# Altium project EPS_V1.PrjPcb
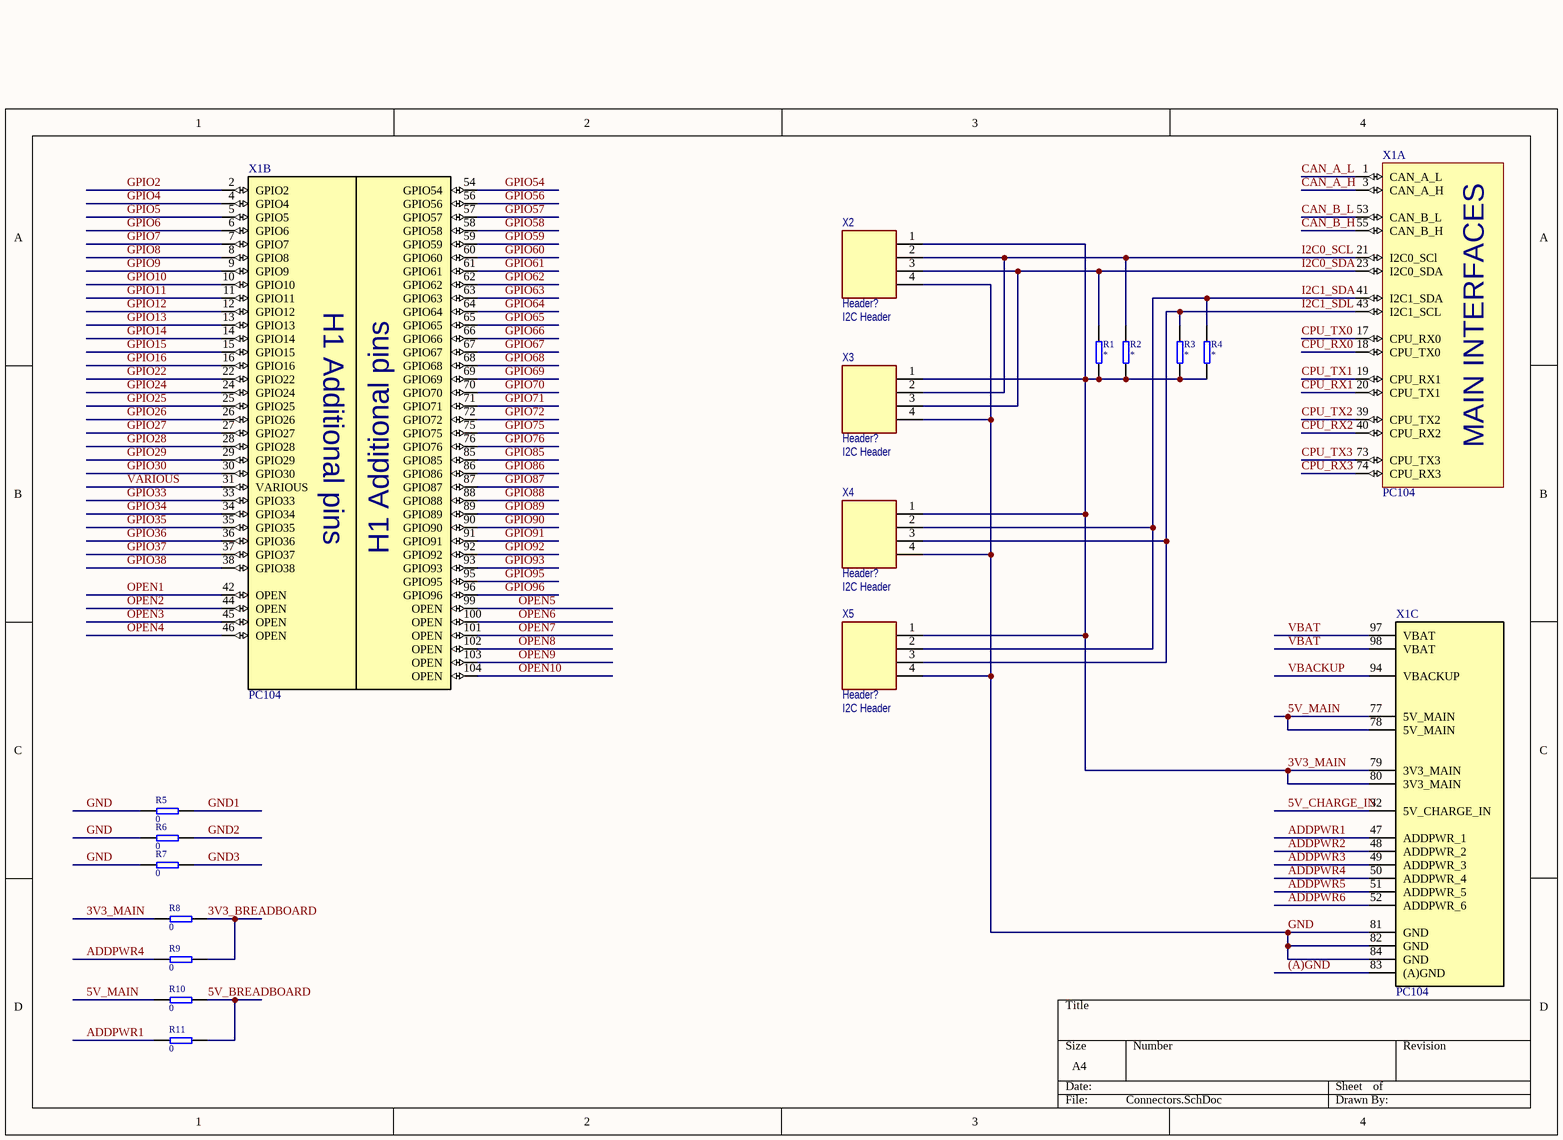
[diagram p0: Connectors.SchDoc]
1 sheet, 16 parts. Net scope: global (net labels, ports and power ports of the same name join across sheets).
Board file: EPS_V1.PcbDoc

## Sheet Connectors.SchDoc
size A4; SheetNumber: 1; SheetTotal: 1

### Parts
R1  (no value)  [RES 0603]
R2  (no value)  [RES 0603]
R3  (no value)  [RES 0603]
R4  (no value)  [RES 0603]
R5  value 0  [RES 0603]
R6  value 0  [RES 0603]
R7  value 0  [RES 0603]
R8  value 0  [RES 0603]
R9  value 0  [RES 0603]
R10  value 0  [RES 0603]
R11  value 0  [RES 0603]
X1  PC104  [PC104_ArianSpace]  (parts A,B,C of 3)
X2  Header?  Purpose: I2C Header  [PicoBlade_4P]
X3  Header?  Purpose: I2C Header  [PicoBlade_4P]
X4  Header?  Purpose: I2C Header  [PicoBlade_4P]
X5  Header?  Purpose: I2C Header  [PicoBlade_4P]

### Nets
3V3_BREADBOARD: R8.2 R9.2
3V3_MAIN: R1.2 R2.1 R3.1 R4.1 R8.1 X1.79(3V3_MAIN) X1.80(3V3_MAIN) X2.1 X3.1 X4.1 X5.1
5V_BREADBOARD: R10.2 R11.2
5V_CHARGE_IN: X1.32(5V_CHARGE_IN)
5V_MAIN: R10.1 X1.77(5V_MAIN) X1.78(5V_MAIN)
(A)GND: X1.83((A)GND)
ADDPWR1: R11.1 X1.47(ADDPWR_1)
ADDPWR2: X1.48(ADDPWR_2)
ADDPWR3: X1.49(ADDPWR_3)
ADDPWR4: R9.1 X1.50(ADDPWR_4)
ADDPWR5: X1.51(ADDPWR_5)
ADDPWR6: X1.52(ADDPWR_6)
CAN_A_H: X1.3(CAN_A_H)
CAN_A_L: X1.1(CAN_A_L)
CAN_B_H: X1.55(CAN_B_H)
CAN_B_L: X1.53(CAN_B_L)
CPU_RX0: X1.18(CPU_TX0)
CPU_RX1: X1.20(CPU_TX1)
CPU_RX2: X1.40(CPU_RX2)
CPU_RX3: X1.74(CPU_RX3)
CPU_TX0: X1.17(CPU_RX0)
CPU_TX1: X1.19(CPU_RX1)
CPU_TX2: X1.39(CPU_TX2)
CPU_TX3: X1.73(CPU_TX3)
GND: R5.1 R6.1 R7.1 X1.81(GND) X1.82(GND) X1.84(GND) X2.4 X3.4 X4.4 X5.4
GND1: R5.2
GND2: R6.2
GND3: R7.2
GPIO2: X1.2(GPIO2)
GPIO4: X1.4(GPIO4)
GPIO5: X1.5(GPIO5)
GPIO6: X1.6(GPIO6)
GPIO7: X1.7(GPIO7)
GPIO8: X1.8(GPIO8)
GPIO9: X1.9(GPIO9)
GPIO10: X1.10(GPIO10)
GPIO11: X1.11(GPIO11)
GPIO12: X1.12(GPIO12)
GPIO13: X1.13(GPIO13)
GPIO14: X1.14(GPIO14)
GPIO15: X1.15(GPIO15)
GPIO16: X1.16(GPIO16)
GPIO22: X1.22(GPIO22)
GPIO24: X1.24(GPIO24)
GPIO25: X1.25(GPIO25)
GPIO26: X1.26(GPIO26)
GPIO27: X1.27(GPIO27)
GPIO28: X1.28(GPIO28)
GPIO29: X1.29(GPIO29)
GPIO30: X1.30(GPIO30)
GPIO33: X1.33(GPIO33)
GPIO34: X1.34(GPIO34)
GPIO35: X1.35(GPIO35)
GPIO36: X1.36(GPIO36)
GPIO37: X1.37(GPIO37)
GPIO38: X1.38(GPIO38)
GPIO54: X1.54(GPIO54)
GPIO56: X1.56(GPIO56)
GPIO57: X1.57(GPIO57)
GPIO58: X1.58(GPIO58)
GPIO59: X1.59(GPIO59)
GPIO60: X1.60(GPIO60)
GPIO61: X1.61(GPIO61)
GPIO62: X1.62(GPIO62)
GPIO63: X1.63(GPIO63)
GPIO64: X1.64(GPIO64)
GPIO65: X1.65(GPIO65)
GPIO66: X1.66(GPIO66)
GPIO67: X1.67(GPIO67)
GPIO68: X1.68(GPIO68)
GPIO69: X1.69(GPIO69)
GPIO70: X1.70(GPIO70)
GPIO71: X1.71(GPIO71)
GPIO72: X1.72(GPIO72)
GPIO75: X1.75(GPIO75)
GPIO76: X1.76(GPIO76)
GPIO85: X1.85(GPIO85)
GPIO86: X1.86(GPIO86)
GPIO87: X1.87(GPIO87)
GPIO88: X1.88(GPIO88)
GPIO89: X1.89(GPIO89)
GPIO90: X1.90(GPIO90)
GPIO91: X1.91(GPIO91)
GPIO92: X1.92(GPIO92)
GPIO93: X1.93(GPIO93)
GPIO95: X1.95(GPIO95)
GPIO96: X1.96(GPIO96)
I2C0_SCL: R2.2 X1.21(I2C0_SCl) X2.2 X3.2
I2C0_SDA: R1.1 X1.23(I2C0_SDA) X2.3 X3.3
I2C1_SDA: R4.2 X1.41(I2C1_SDA) X4.2 X5.2
I2C1_SDL: R3.2 X1.43(I2C1_SCL) X4.3 X5.3
OPEN1: X1.42(OPEN)
OPEN2: X1.44(OPEN)
OPEN3: X1.45(OPEN)
OPEN4: X1.46(OPEN)
OPEN5: X1.99(OPEN)
OPEN6: X1.100(OPEN)
OPEN7: X1.101(OPEN)
OPEN8: X1.102(OPEN)
OPEN9: X1.103(OPEN)
OPEN10: X1.104(OPEN)
VARIOUS: X1.31(VARIOUS)
VBACKUP: X1.94(VBACKUP)
VBAT: X1.97(VBAT) X1.98(VBAT)

### Notes on the sheet
- (in symbol PC104_ArianSpace, part A) MAIN INTERFACES
- (in symbol PC104_ArianSpace, part B) H1 Additional pins

### Library data of the parts
R1-R11 = !Resistor: Resistor; IsSMT: NoSMT
  R1-R4: Value: *
X1 = PC104_ArianSpace: PC104 connector
X2-X5 = Header 1x4: 4x1 header; IsSMT: NoSMT